# Altium schematic sheet Single-ADC_ADS1252U.SchDoc
size A4; SheetNumber: 10; SheetTotal: 10
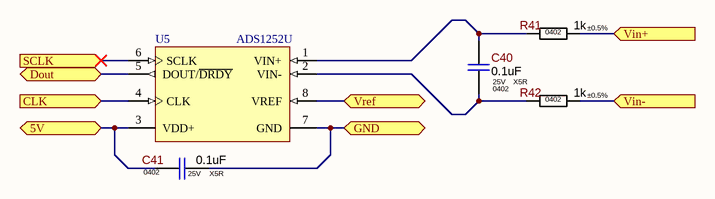
[diagram p0: Single-ADC_ADS1252U.SchDoc]

## Parts
C40  Package: 0402  Voltage: 25V  Dielectric Type: X5R  [C_CERAMIC_0402_MED]  (hidden comment: 0.1uF)
C41  Package: 0402  Voltage: 25V  Dielectric Type: X5R  [C_CERAMIC_0402_HI]  (hidden comment: 0.1uF)
R41  Tolerance: ±0.5%  Package: 0402  [R_ANY_CHIP_0402_HI]  (hidden comment: 1k)
R42  Tolerance: ±0.5%  Package: 0402  [R_ANY_CHIP_0402_HI]  (hidden comment: 1k)
U5  ADS1252U  [TI-D8_M]

## Ports
5V (bidir, see KelvinVoltageMeasureModule[4C]), CLK (in, see KelvinVoltageMeasureModule[4C]), Dout (bidir, see KelvinVoltageMeasureModule[4C]), GND (bidir, see KelvinVoltageMeasureModule[4C]), SCLK (in), Vin+ (in, see KelvinVoltageMeasureModule[5C]), Vin- (in, see KelvinVoltageMeasureModule[5C]), Vref (bidir, see KelvinVoltageMeasureModule[4D])

## Nets
5V: C41.1 U5.3(VDD+) ; port 5V
CLK: U5.4(CLK) ; port CLK
Dout: U5.5(DOUT/~{DRDY}) ; port Dout
GND: C41.2 U5.7(GND) ; port GND
SCLK: U5.6(SCLK) ; port SCLK
Vin+: R41.1 ; port Vin+
Vin-: R42.1 ; port Vin-
Vref: U5.8(VREF) ; port Vref
NetC40_1: C40.1 R41.2 U5.1(VIN+)
NetC40_2: C40.2 R42.2 U5.2(VIN-)

## Library data of the parts
C40 C41 = CL05A104KA5NNNC: 100nF 25V X5R ±10% 0402 Ceramic Capacitor RoHS; Manufacturer: Samsung Electro-Mechanics; Standard Lead Time: 38 Weeks; Component Status: Released; Replacement: NONE; Part Number: CL05A104KA5NNNC; Part Type: Ceramic / X5R / 0402; Component Type: SMD; Temperature Range: -55°C ~ 85°C; Tolerance: ±10%; ComponentLink1URL: https://eu.mouser.com/datasheet/2/585/MLCC-1837944.pdf; ComponentLink1Description: Datasheet; Price: 0.0013; Supplier 1: Mouser; Supplier Part Number 1: 187-CL05A104KA5NNNC; Value: 0.1uF
R41 R42 = RC0402DR-071KL: 1 kOhms ±0.5% 1/16W 0402 Thick Film Resistor; Manufacturer: Yageo; Power Rating: 0.062W; Voltage: 50V; Component Status: Released; Temperature Stability: ±100ppm/°C; Replacement: NONE; Part Number: RC0402DR-071KL; Component Type: SMD; Part Type: Thick Film; Temperature Range: -55°C ~ 155°C; ComponentLink1URL: https://www.yageo.com/upload/media/product/productsearch/datasheet/rchip/PYu-RC_Group_51_RoHS_L_12.pdf; Supplier 1: Digi-Key; Supplier Part Number 1: 13-RC0402DR-071KLTR-ND; Price: 0.015; ComponentLink1Description: Datasheet; Value: 1k
U5 = CMP-0003-00072-2: ResolutionPlus 24-Bit, 40 kHz ADC, -40 to 85 degC, 8-pin SOIC (D8), Green (RoHS & no Sb/Br); Manufacturer: Texas Instruments; Analog Voltage AV/DD(Max)(V): 5.25; # Input Channels: 1; Architecture: Delta-Sigma; Sample Rate (max)(SPS): 41k; Digital Supply(Min)(V): 4.75; Resolution(Bits): 24; Interface: Serial SPI; SubFamily: Precision ADC (<=10MSPS); ComponentLink1URL: http://www.ti.com/; Code_JEDEC: MS-012; ComponentLink3Description: Package Specification; PackageVersion: 4040047-3/M, 06/2011; PackageReference: D8; ComponentLink2URL: http://www.ti.com/general/docs/lit/getliterature.tsp?genericPartNumber=ADS1252&fileType=pdf; INL(Max)(+/-LSB): 1; DatasheetVersion: SBAS127D; ComponentLink3URL: http://www.ti.com/litv/pdf/msoi002j; Mounting Technology: Surface Mount; ComponentLink1Description: Manufacturer URL; PackageDescription: 8-Pin Plastic Small Outline, Body 4.9 x 3.9 mm, Pitch 1.27 mm; PartNumber: ADS1252U; Analog Voltage AV/DD(Min)(V): 4.75; ComponentLink2Description: Datasheet; Eco-Plan: Green (RoHS & no Sb/Br); Digital Supply(Max)(V): 5.25; Part Number: ADS1252U; Supplier 1: Mouser; Supplier Part Number 1: 595-ADS1252U